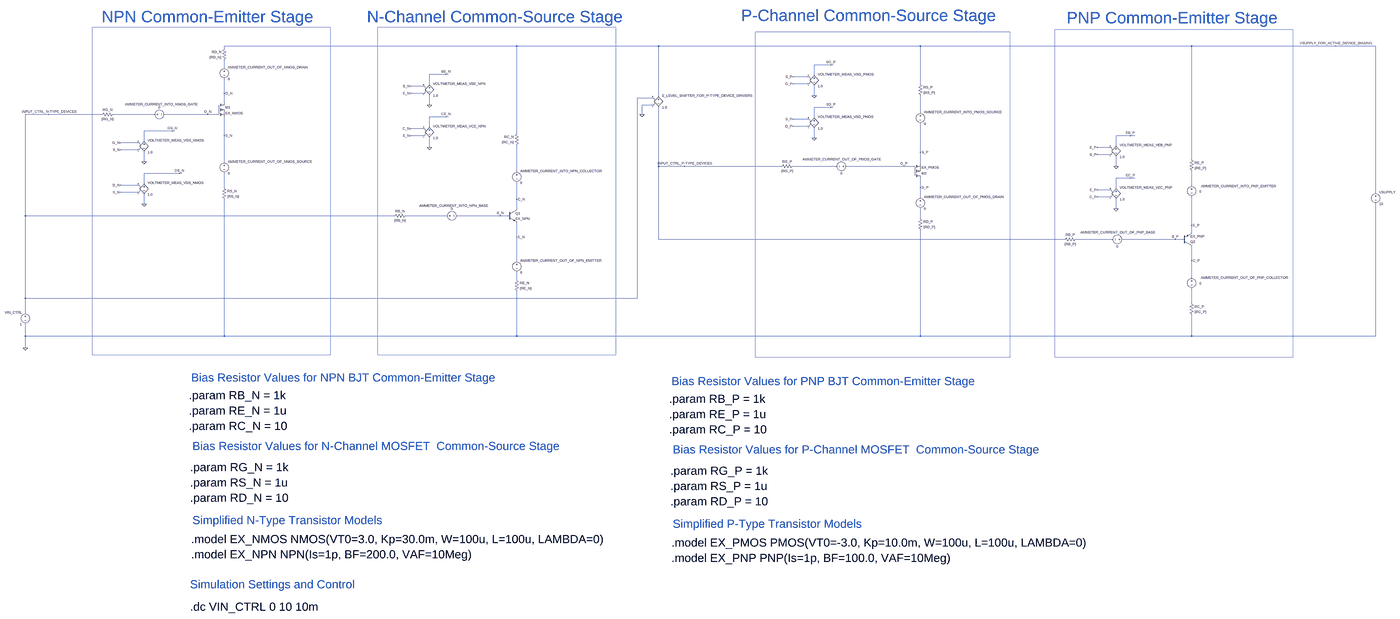
[diagram p0: schematic Transistor_Common_Source_Common_Emitter_Golden_Reference_Test_Bench.asc, whole sheet]
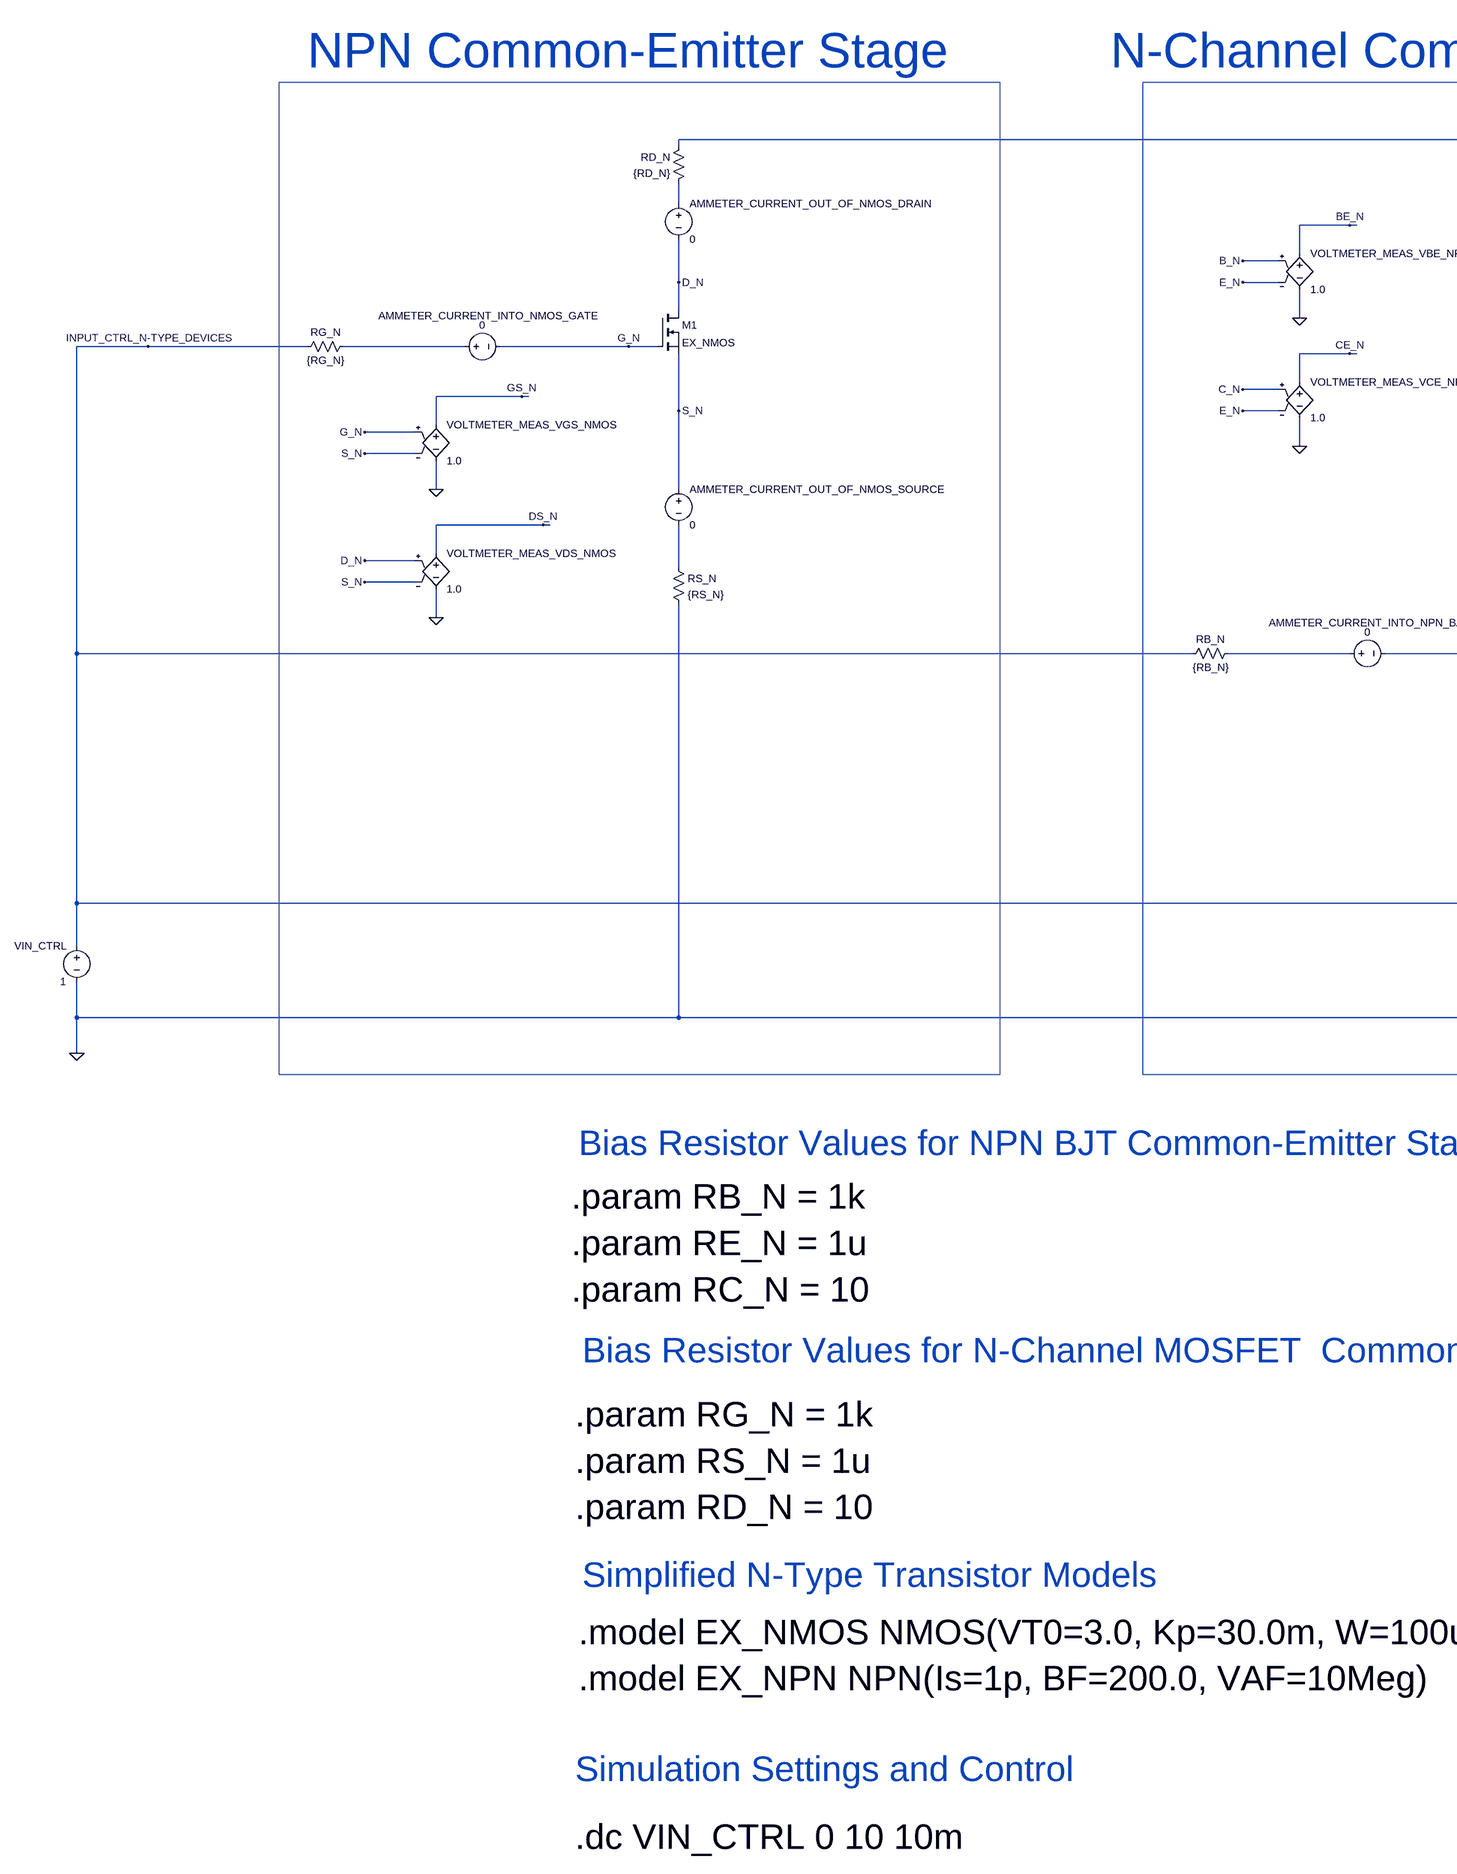
[diagram p1: schematic Transistor_Common_Source_Common_Emitter_Golden_Reference_Test_Bench.asc, part, row 1 of 1, column 1 of 3]
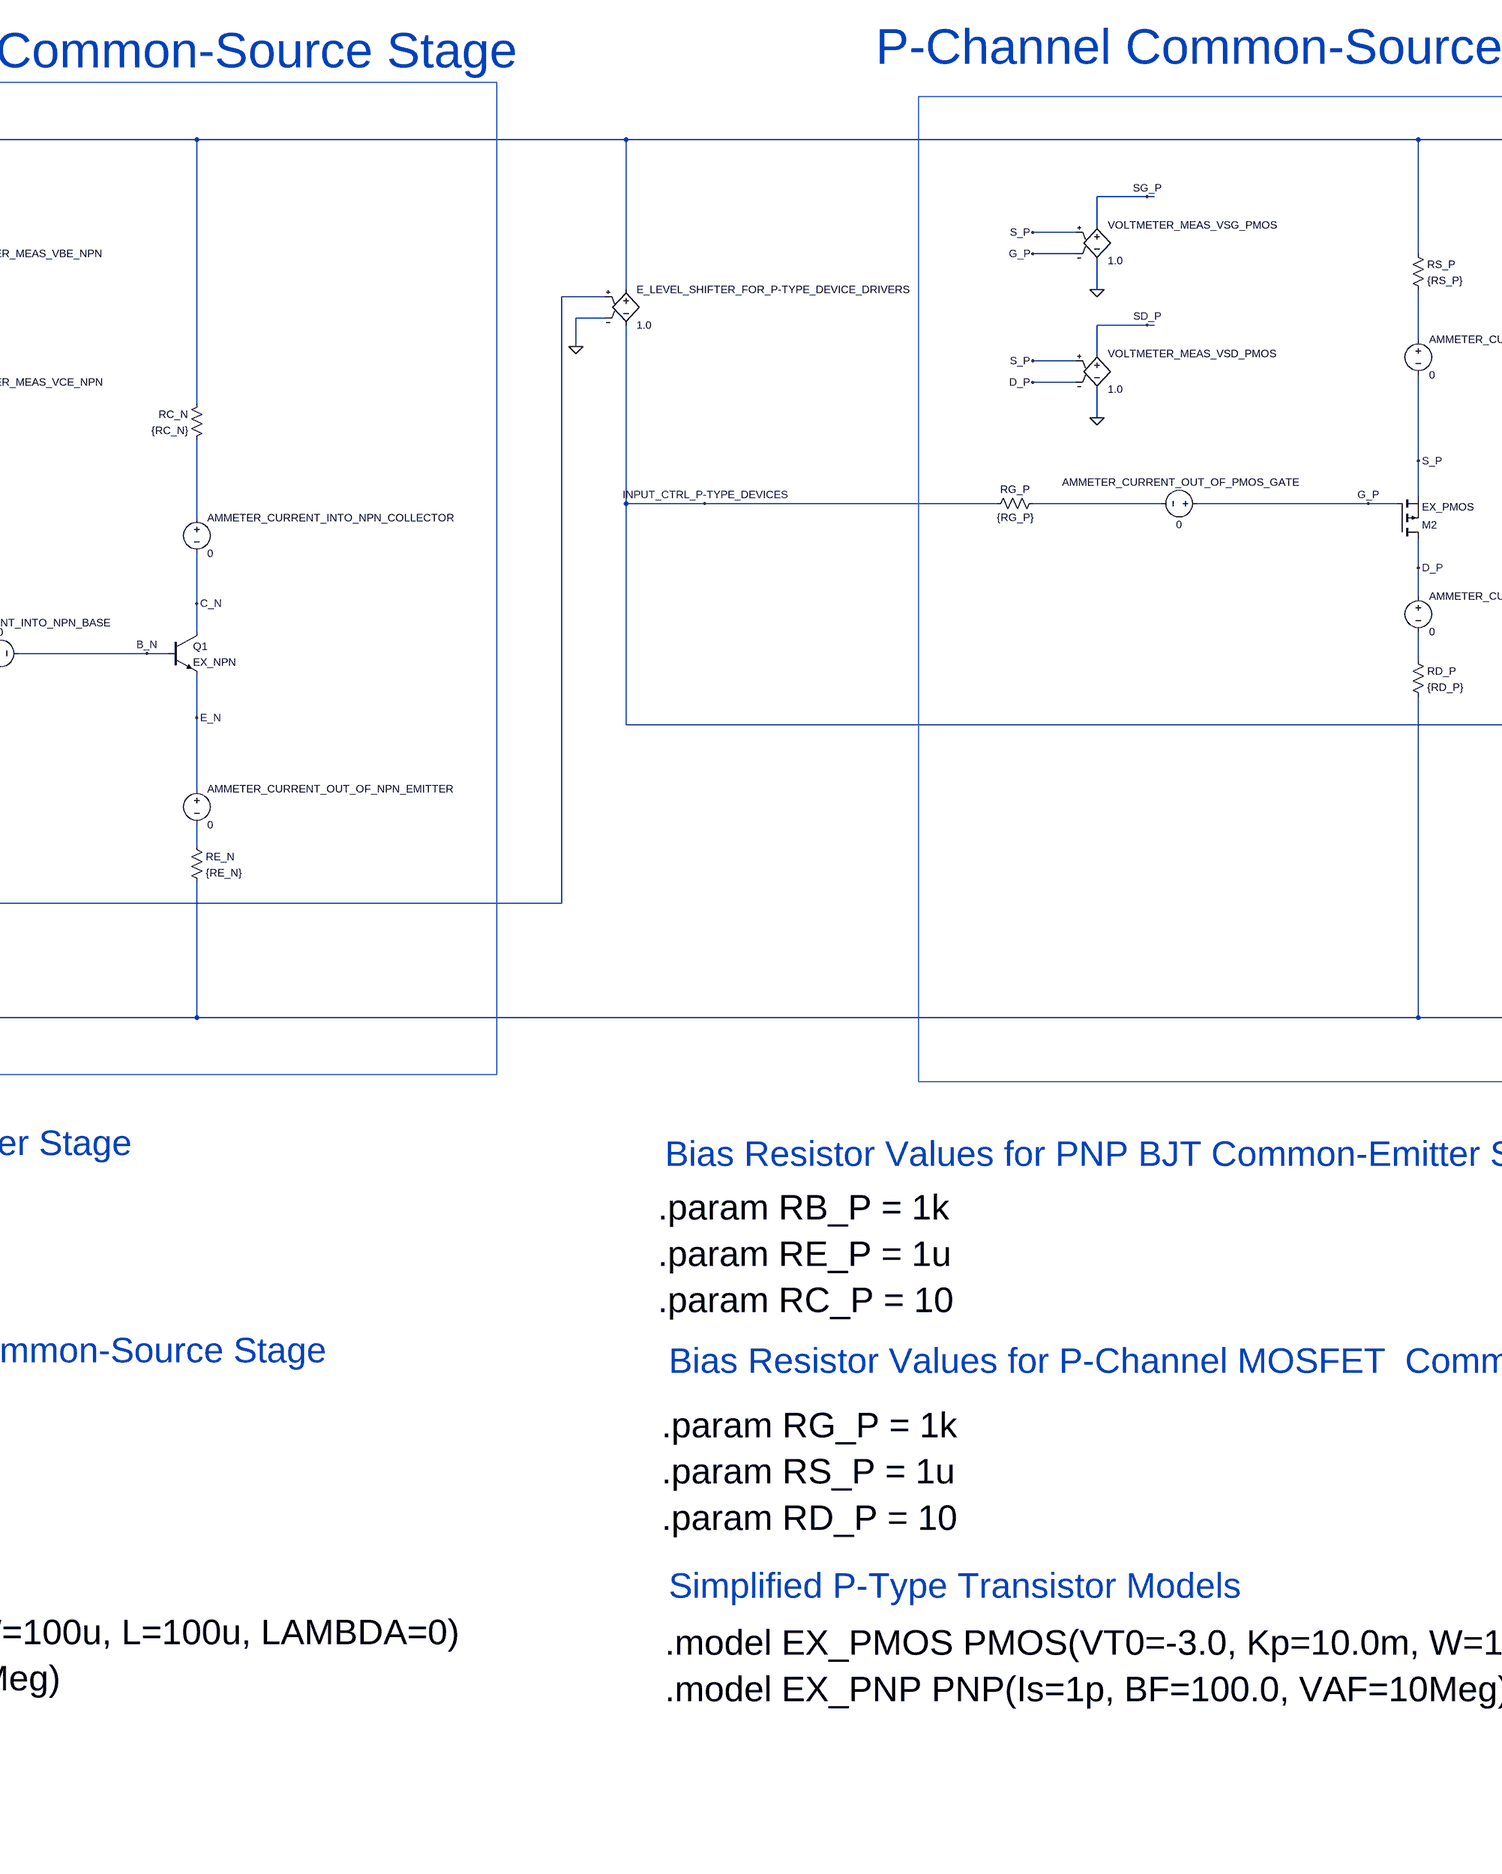
[diagram p2: schematic Transistor_Common_Source_Common_Emitter_Golden_Reference_Test_Bench.asc, part, row 1 of 1, column 2 of 3]
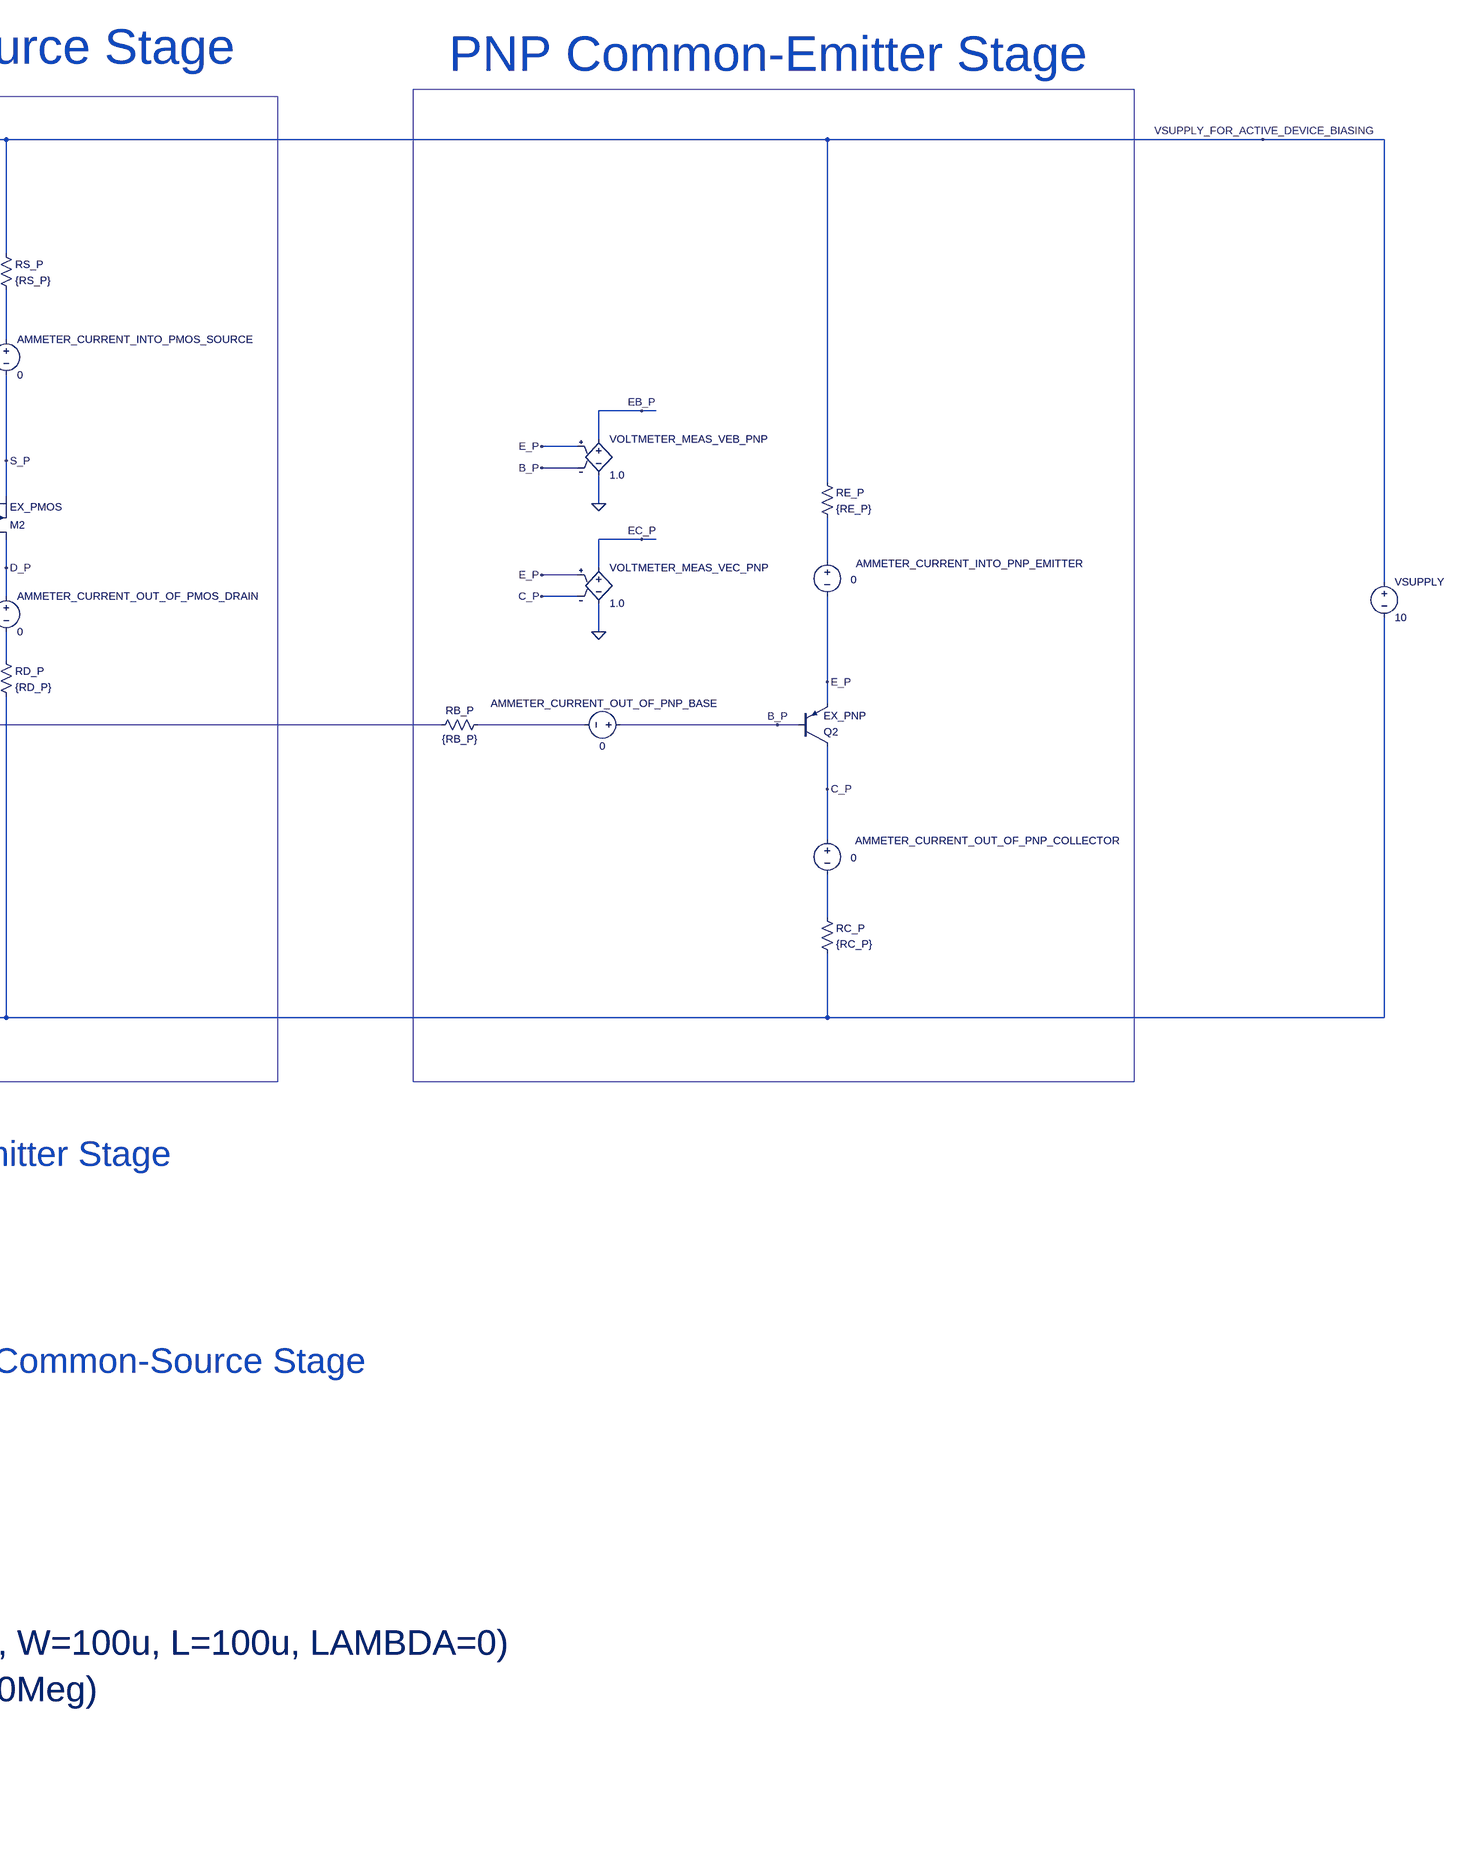
[diagram p3: schematic Transistor_Common_Source_Common_Emitter_Golden_Reference_Test_Bench.asc, part, row 1 of 1, column 3 of 3]
Transistor_Common_Source_Common_Emitter_Golden_Reference_Test_Bench.asc, the LTspice schematic file:
Version 4.1
SHEET 1 8076 3632
WIRE 768 -784 -1216 -784
WIRE 1888 -784 768 -784
WIRE 3664 -784 1888 -784
WIRE 5504 -784 3664 -784
WIRE 6480 -784 5504 -784
WIRE 6752 -784 6480 -784
WIRE -1216 -768 -1216 -784
WIRE 3056 -656 2944 -656
WIRE 3072 -656 3056 -656
WIRE -1216 -640 -1216 -688
WIRE 288 -592 176 -592
WIRE 304 -592 288 -592
WIRE 2944 -592 2944 -656
WIRE 2896 -576 2800 -576
WIRE 176 -528 176 -592
WIRE 2896 -528 2800 -528
WIRE 3664 -528 3664 -784
WIRE 128 -512 48 -512
WIRE -1216 -464 -1216 -560
WIRE 128 -464 48 -464
WIRE 1888 -448 1888 -784
WIRE 2944 -448 2944 -512
WIRE 1840 -432 1744 -432
WIRE -1216 -400 -1216 -464
WIRE 176 -384 176 -448
WIRE 1840 -384 1776 -384
WIRE 3056 -368 2944 -368
WIRE 3072 -368 3056 -368
WIRE 3664 -336 3664 -448
WIRE -2864 -320 -3024 -320
WIRE -2048 -320 -2864 -320
WIRE -1696 -320 -1968 -320
WIRE -1328 -320 -1616 -320
WIRE -1264 -320 -1328 -320
WIRE 1776 -320 1776 -384
WIRE 288 -304 176 -304
WIRE 304 -304 288 -304
WIRE 2944 -304 2944 -368
WIRE 2896 -288 2800 -288
WIRE 176 -240 176 -304
WIRE 2896 -240 2800 -240
WIRE 128 -224 48 -224
WIRE -1568 -208 -1760 -208
WIRE -1552 -208 -1568 -208
WIRE 768 -192 768 -784
WIRE -1216 -176 -1216 -304
WIRE 128 -176 48 -176
WIRE 5088 -176 4992 -176
WIRE 5120 -176 5088 -176
WIRE 2944 -160 2944 -224
WIRE -1760 -144 -1760 -208
WIRE -1808 -128 -1920 -128
WIRE 4992 -112 4992 -176
WIRE 176 -96 176 -160
WIRE 4944 -96 4864 -96
WIRE -1808 -80 -1920 -80
WIRE 3664 -64 3664 -256
WIRE 4944 -48 4864 -48
WIRE 5504 -16 5504 -784
WIRE -1760 0 -1760 -64
WIRE -1216 0 -1216 -176
WIRE 3664 16 3664 -64
WIRE 1888 32 1888 -368
WIRE 2064 32 1888 32
WIRE 2720 32 2064 32
WIRE 3088 32 2800 32
WIRE 3552 32 3168 32
WIRE 3616 32 3552 32
WIRE 4992 32 4992 -32
WIRE 768 64 768 -112
WIRE -1520 80 -1760 80
WIRE -1504 80 -1520 80
WIRE 5088 112 4992 112
WIRE 5120 112 5088 112
WIRE -1760 144 -1760 80
WIRE -1808 160 -1920 160
WIRE 5504 160 5504 64
WIRE -1216 176 -1216 80
WIRE 3664 176 3664 112
WIRE 4992 176 4992 112
WIRE 4944 192 4864 192
WIRE -1808 208 -1920 208
WIRE 6752 208 6752 -784
WIRE 3664 240 3664 176
WIRE 4944 240 4864 240
WIRE 768 256 768 144
WIRE -1760 288 -1760 224
WIRE 768 320 768 256
WIRE 4992 320 4992 256
WIRE -3024 368 -3024 -320
WIRE -64 368 -3024 368
WIRE 288 368 16 368
WIRE 656 368 368 368
WIRE 704 368 656 368
WIRE 3664 384 3664 320
WIRE 5504 432 5504 240
WIRE 5504 480 5504 432
WIRE 768 512 768 416
WIRE 1888 528 1888 32
WIRE 4640 528 1888 528
WIRE 4960 528 4720 528
WIRE 5392 528 5040 528
WIRE 5440 528 5392 528
WIRE 768 672 768 512
WIRE 5504 672 5504 576
WIRE 5504 784 5504 672
WIRE 768 800 768 752
WIRE -3024 928 -3024 368
WIRE 1744 928 1744 -432
WIRE 1744 928 -3024 928
WIRE 5504 960 5504 864
WIRE -3024 1024 -3024 928
WIRE -3024 1184 -3024 1104
WIRE -1216 1184 -1216 256
WIRE -1216 1184 -3024 1184
WIRE 768 1184 768 880
WIRE 768 1184 -1216 1184
WIRE 3664 1184 3664 464
WIRE 3664 1184 768 1184
WIRE 5504 1184 5504 1040
WIRE 5504 1184 3664 1184
WIRE 6752 1184 6752 288
WIRE 6752 1184 5504 1184
WIRE -3024 1264 -3024 1184
FLAG 656 368 B_N
FLAG -1328 -320 G_N
FLAG -1216 -464 D_N
FLAG 768 256 C_N
FLAG -3024 1264 0
FLAG 6480 -784 VSUPPLY_FOR_ACTIVE_DEVICE_BIASING
FLAG -2864 -320 INPUT_CTRL_N-TYPE_DEVICES
FLAG 176 -96 0
FLAG 288 -304 CE_N
FLAG -1760 288 0
FLAG -1520 80 DS_N
FLAG -1216 -176 S_N
FLAG 768 512 E_N
FLAG -1760 0 0
FLAG -1568 -208 GS_N
FLAG 176 -384 0
FLAG 288 -592 BE_N
FLAG 1776 -320 0
FLAG 3552 32 G_P
FLAG 3664 176 D_P
FLAG 3664 -64 S_P
FLAG 5392 528 B_P
FLAG 5504 672 C_P
FLAG 5504 432 E_P
FLAG 2944 -160 0
FLAG 3056 -368 SD_P
FLAG 5088 112 EC_P
FLAG 5088 -176 EB_P
FLAG 2944 -448 0
FLAG 3056 -656 SG_P
FLAG 2064 32 INPUT_CTRL_P-TYPE_DEVICES
FLAG 48 -176 E_N
FLAG 48 -464 E_N
FLAG 48 -512 B_N
FLAG 48 -224 C_N
FLAG -1920 -80 S_N
FLAG -1920 208 S_N
FLAG -1920 160 D_N
FLAG -1920 -128 G_N
FLAG 4992 320 0
FLAG 4992 32 0
FLAG 4864 192 E_P
FLAG 4864 -96 E_P
FLAG 4864 -48 B_P
FLAG 4864 240 C_P
FLAG 2800 -576 S_P
FLAG 2800 -288 S_P
FLAG 2800 -528 G_P
FLAG 2800 -240 D_P
SYMBOL npn 704 320 R0
SYMATTR InstName Q1
SYMATTR Value EX_NPN
SYMBOL nmos -1264 -400 R0
SYMATTR InstName M1
SYMATTR Value EX_NMOS
SYMBOL res -80 384 R270
WINDOW 0 32 56 VTop 2
WINDOW 3 0 56 VBottom 2
SYMATTR InstName RB_N
SYMATTR Value {RB_N}
SYMBOL res -2064 -304 R270
WINDOW 0 32 56 VTop 2
WINDOW 3 0 56 VBottom 2
SYMATTR InstName RG_N
SYMATTR Value {RG_N}
SYMBOL voltage -3024 1008 M0
WINDOW 123 0 0 Left 0
WINDOW 39 0 0 Left 0
SYMATTR InstName VIN_CTRL
SYMATTR Value 1
SYMBOL res -1200 -784 M0
SYMATTR InstName RD_N
SYMATTR Value {RD_N}
SYMBOL res 784 -208 M0
SYMATTR InstName RC_N
SYMATTR Value {RC_N}
SYMBOL voltage 6752 192 R0
WINDOW 123 0 0 Left 0
WINDOW 39 0 0 Left 0
SYMATTR InstName VSUPPLY
SYMATTR Value 10
SYMBOL res 752 784 R0
SYMATTR InstName RE_N
SYMATTR Value {RE_N}
SYMBOL res -1232 160 R0
SYMATTR InstName RS_N
SYMATTR Value {RS_N}
SYMBOL e 176 -256 R0
SYMATTR InstName VOLTMETER_MEAS_VCE_NPN
SYMATTR Value 1.0
SYMBOL e -1760 128 R0
SYMATTR InstName VOLTMETER_MEAS_VDS_NMOS
SYMATTR Value 1.0
SYMBOL e -1760 -160 R0
SYMATTR InstName VOLTMETER_MEAS_VGS_NMOS
SYMATTR Value 1.0
SYMBOL e 176 -544 R0
SYMATTR InstName VOLTMETER_MEAS_VBE_NPN
SYMATTR Value 1.0
SYMBOL e 1888 -464 R0
SYMATTR InstName E_LEVEL_SHIFTER_FOR_P-TYPE_DEVICE_DRIVERS
SYMATTR Value 1.0
SYMBOL res 4736 512 R90
WINDOW 0 0 56 VBottom 2
WINDOW 3 32 56 VTop 2
SYMATTR InstName RB_P
SYMATTR Value {RB_P}
SYMBOL res 2816 16 R90
WINDOW 0 0 56 VBottom 2
WINDOW 3 32 56 VTop 2
SYMATTR InstName RG_P
SYMATTR Value {RG_P}
SYMBOL res 3648 368 R0
SYMATTR InstName RD_P
SYMATTR Value {RD_P}
SYMBOL res 3648 -544 R0
SYMATTR InstName RS_P
SYMATTR Value {RS_P}
SYMBOL pmos 3616 112 M180
SYMATTR InstName M2
SYMATTR Value EX_PMOS
SYMBOL res 5488 944 R0
SYMATTR InstName RC_P
SYMATTR Value {RC_P}
SYMBOL res 5488 -32 R0
SYMATTR InstName RE_P
SYMATTR Value {RE_P}
SYMBOL pnp 5440 576 M180
SYMATTR InstName Q2
SYMATTR Value EX_PNP
SYMBOL e 2944 -320 R0
SYMATTR InstName VOLTMETER_MEAS_VSD_PMOS
SYMATTR Value 1.0
SYMBOL e 4992 160 R0
SYMATTR InstName VOLTMETER_MEAS_VEC_PNP
SYMATTR Value 1.0
SYMBOL e 4992 -128 R0
SYMATTR InstName VOLTMETER_MEAS_VEB_PNP
SYMATTR Value 1.0
SYMBOL e 2944 -608 R0
SYMATTR InstName VOLTMETER_MEAS_VSG_PMOS
SYMATTR Value 1.0
SYMBOL voltage 5056 528 R90
WINDOW 0 -32 56 VBottom 2
WINDOW 3 32 56 VTop 2
WINDOW 123 0 0 Left 0
WINDOW 39 0 0 Left 0
SYMATTR InstName AMMETER_CURRENT_OUT_OF_PNP_BASE
SYMATTR Value 0
SYMBOL voltage 5504 768 R0
WINDOW 0 355 35 Bottom 2
WINDOW 3 59 43 Top 2
WINDOW 123 0 0 Left 0
WINDOW 39 0 0 Left 0
SYMATTR InstName AMMETER_CURRENT_OUT_OF_PNP_COLLECTOR
SYMATTR Value 0
SYMBOL voltage 5504 144 R0
WINDOW 0 316 38 Bottom 2
WINDOW 3 59 43 Top 2
WINDOW 123 0 0 Left 0
WINDOW 39 0 0 Left 0
SYMATTR InstName AMMETER_CURRENT_INTO_PNP_EMITTER
SYMATTR Value 0
SYMBOL voltage 3184 32 R90
WINDOW 0 -32 56 VBottom 2
WINDOW 3 32 56 VTop 2
WINDOW 123 0 0 Left 0
WINDOW 39 0 0 Left 0
SYMATTR InstName AMMETER_CURRENT_OUT_OF_PMOS_GATE
SYMATTR Value 0
SYMBOL voltage 3664 224 R0
WINDOW 123 0 0 Left 0
WINDOW 39 0 0 Left 0
SYMATTR InstName AMMETER_CURRENT_OUT_OF_PMOS_DRAIN
SYMATTR Value 0
SYMBOL voltage 3664 -352 R0
WINDOW 123 0 0 Left 0
WINDOW 39 0 0 Left 0
SYMATTR InstName AMMETER_CURRENT_INTO_PMOS_SOURCE
SYMATTR Value 0
SYMBOL voltage 272 368 R270
WINDOW 0 84 66 VBottom 2
WINDOW 3 32 56 VTop 2
WINDOW 123 0 0 Left 0
WINDOW 39 0 0 Left 0
SYMATTR InstName AMMETER_CURRENT_INTO_NPN_BASE
SYMATTR Value 0
SYMBOL voltage 768 48 R0
WINDOW 123 0 0 Left 0
WINDOW 39 0 0 Left 0
SYMATTR InstName AMMETER_CURRENT_INTO_NPN_COLLECTOR
SYMATTR Value 0
SYMBOL voltage 768 656 R0
WINDOW 123 0 0 Left 0
WINDOW 39 0 0 Left 0
SYMATTR InstName AMMETER_CURRENT_OUT_OF_NPN_EMITTER
SYMATTR Value 0
SYMBOL voltage -1216 -16 R0
WINDOW 123 0 0 Left 0
WINDOW 39 0 0 Left 0
SYMATTR InstName AMMETER_CURRENT_OUT_OF_NMOS_SOURCE
SYMATTR Value 0
SYMBOL voltage -1216 -656 R0
WINDOW 123 0 0 Left 0
WINDOW 39 0 0 Left 0
SYMATTR InstName AMMETER_CURRENT_OUT_OF_NMOS_DRAIN
SYMATTR Value 0
SYMBOL voltage -1712 -320 R270
WINDOW 0 84 66 VBottom 2
WINDOW 3 32 56 VTop 2
WINDOW 123 0 0 Left 0
WINDOW 39 0 0 Left 0
SYMATTR InstName AMMETER_CURRENT_INTO_NMOS_GATE
SYMATTR Value 0
TEXT -1456 1656 Left 6 !.param RB_N = 1k\n.param RE_N = 1u\n.param RC_N = 10
TEXT -1448 2144 Left 6 !.param RG_N = 1k\n.param RS_N = 1u\n.param RD_N = 10
TEXT -1440 1536 Left 6 ;Bias Resistor Values for NPN BJT Common-Emitter Stage
TEXT -1432 2000 Left 6 ;Bias Resistor Values for N-Channel MOSFET  Common-Source Stage
TEXT -1440 2632 Left 6 !.model EX_NMOS NMOS(VT0=3.0, Kp=30.0m, W=100u, L=100u, LAMBDA=0)\n.model EX_NPN NPN(Is=1p, BF=200.0, VAF=10Meg)
TEXT -1432 2504 Left 6 ;Simplified N-Type Transistor Models
TEXT -1448 3288 Left 6 !.dc VIN_CTRL 0 10 10m
TEXT -1448 3136 Left 6 ;Simulation Settings and Control
TEXT 1960 1680 Left 6 !.param RB_P = 1k\n.param RE_P = 1u\n.param RC_P = 10
TEXT 1968 2168 Left 6 !.param RG_P = 1k\n.param RS_P = 1u\n.param RD_P = 10
TEXT 1976 1560 Left 6 ;Bias Resistor Values for PNP BJT Common-Emitter Stage
TEXT 1984 2024 Left 6 ;Bias Resistor Values for P-Channel MOSFET  Common-Source Stage
TEXT 1976 2656 Left 6 !.model EX_PMOS PMOS(VT0=-3.0, Kp=10.0m, W=100u, L=100u, LAMBDA=0)\n.model EX_PNP PNP(Is=1p, BF=100.0, VAF=10Meg)
TEXT 1984 2528 Left 6 ;Simplified P-Type Transistor Models
TEXT -2048 -984 Left 7 ;NPN Common-Emitter Stage
TEXT -248 -984 Left 7 ;N-Channel Common-Source Stage
TEXT 4656 -976 Left 7 ;PNP Common-Emitter Stage
TEXT 2448 -992 Left 7 ;P-Channel Common-Source Stage
RECTANGLE Normal -496 1312 -2112 -912
RECTANGLE Normal 1440 1312 -176 -912
RECTANGLE Normal 4272 1328 2544 -880
RECTANGLE Normal 6192 1328 4576 -896

The netlist it stands for:
* Transistor_Common_Source_Common_Emitter_Golden_Reference_Test_Bench.asc
Q1 C_N B_N E_N 0 EX_NPN
M1 D_N G_N S_N S_N EX_NMOS
RB_N INPUT_CTRL_N-TYPE_DEVICES N008 {RB_N}
RG_N INPUT_CTRL_N-TYPE_DEVICES N003 {RG_N}
VIN_CTRL INPUT_CTRL_N-TYPE_DEVICES 0 1
RD_N VSUPPLY_FOR_ACTIVE_DEVICE_BIASING N001 {RD_N}
RC_N VSUPPLY_FOR_ACTIVE_DEVICE_BIASING N005 {RC_N}
VSUPPLY VSUPPLY_FOR_ACTIVE_DEVICE_BIASING 0 10
RE_N N011 0 {RE_N}
RS_N N007 0 {RS_N}
E§VOLTMETER_MEAS_VCE_NPN CE_N 0 C_N E_N 1.0
E§VOLTMETER_MEAS_VDS_NMOS DS_N 0 D_N S_N 1.0
E§VOLTMETER_MEAS_VGS_NMOS GS_N 0 G_N S_N 1.0
E§VOLTMETER_MEAS_VBE_NPN BE_N 0 B_N E_N 1.0
E_LEVEL_SHIFTER_FOR_P-TYPE_DEVICE_DRIVERS VSUPPLY_FOR_ACTIVE_DEVICE_BIASING INPUT_CTRL_P-TYPE_DEVICES INPUT_CTRL_N-TYPE_DEVICES 0 1.0
RB_P N010 INPUT_CTRL_P-TYPE_DEVICES {RB_P}
RG_P N004 INPUT_CTRL_P-TYPE_DEVICES {RG_P}
RD_P N009 0 {RD_P}
RS_P VSUPPLY_FOR_ACTIVE_DEVICE_BIASING N002 {RS_P}
M2 D_P G_P S_P S_P EX_PMOS
RC_P N012 0 {RC_P}
RE_P VSUPPLY_FOR_ACTIVE_DEVICE_BIASING N006 {RE_P}
Q2 C_P B_P E_P 0 EX_PNP
E§VOLTMETER_MEAS_VSD_PMOS SD_P 0 S_P D_P 1.0
E§VOLTMETER_MEAS_VEC_PNP EC_P 0 E_P C_P 1.0
E§VOLTMETER_MEAS_VEB_PNP EB_P 0 E_P B_P 1.0
E§VOLTMETER_MEAS_VSG_PMOS SG_P 0 S_P G_P 1.0
V§AMMETER_CURRENT_OUT_OF_PNP_BASE B_P N010 0
V§AMMETER_CURRENT_OUT_OF_PNP_COLLECTOR C_P N012 0
V§AMMETER_CURRENT_INTO_PNP_EMITTER N006 E_P 0
V§AMMETER_CURRENT_OUT_OF_PMOS_GATE G_P N004 0
V§AMMETER_CURRENT_OUT_OF_PMOS_DRAIN D_P N009 0
V§AMMETER_CURRENT_INTO_PMOS_SOURCE N002 S_P 0
V§AMMETER_CURRENT_INTO_NPN_BASE N008 B_N 0
V§AMMETER_CURRENT_INTO_NPN_COLLECTOR N005 C_N 0
V§AMMETER_CURRENT_OUT_OF_NPN_EMITTER E_N N011 0
V§AMMETER_CURRENT_OUT_OF_NMOS_SOURCE S_N N007 0
V§AMMETER_CURRENT_OUT_OF_NMOS_DRAIN N001 D_N 0
V§AMMETER_CURRENT_INTO_NMOS_GATE N003 G_N 0
.model NPN NPN
.model PNP PNP
.lib standard.bjt
.model NMOS NMOS
.model PMOS PMOS
.lib standard.mos
.param RB_N = 1k
.param RE_N = 1u
.param RC_N = 10
.param RG_N = 1k
.param RS_N = 1u
.param RD_N = 10
* Bias Resistor Values for NPN BJT Common-Emitter Stage
* Bias Resistor Values for N-Channel MOSFET  Common-Source Stage
.model EX_NMOS NMOS(VT0=3.0, Kp=30.0m, W=100u, L=100u, LAMBDA=0)
.model EX_NPN NPN(Is=1p, BF=200.0, VAF=10Meg)
* Simplified N-Type Transistor Models
.dc VIN_CTRL 0 10 10m
* Simulation Settings and Control
.param RB_P = 1k
.param RE_P = 1u
.param RC_P = 10
.param RG_P = 1k
.param RS_P = 1u
.param RD_P = 10
* Bias Resistor Values for PNP BJT Common-Emitter Stage
* Bias Resistor Values for P-Channel MOSFET  Common-Source Stage
.model EX_PMOS PMOS(VT0=-3.0, Kp=10.0m, W=100u, L=100u, LAMBDA=0)
.model EX_PNP PNP(Is=1p, BF=100.0, VAF=10Meg)
* Simplified P-Type Transistor Models
* NPN Common-Emitter Stage
* N-Channel Common-Source Stage
* PNP Common-Emitter Stage
* P-Channel Common-Source Stage
.backanno
.end